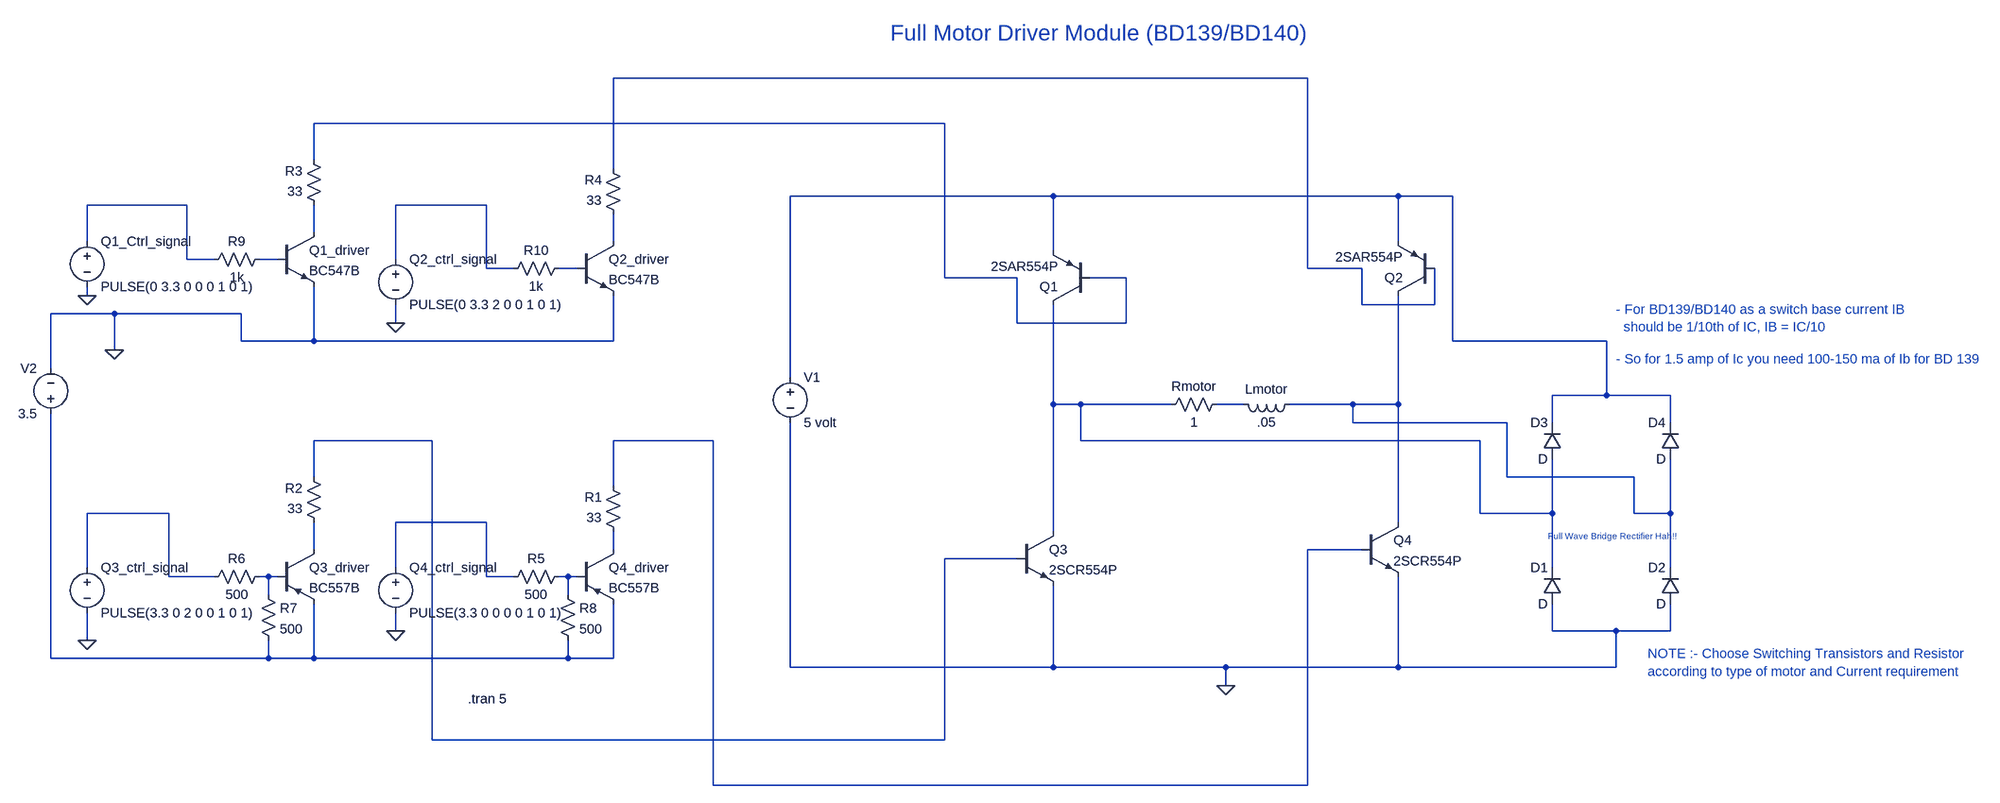
[diagram p0: schematic Full Motor Driver Module ( version 1 ).asc]
Full Motor Driver Module ( version 1 ).asc, the LTspice schematic file:
Version 4
SHEET 1 1904 980
WIRE 656 -272 -720 -272
WIRE 16 -192 -1248 -192
WIRE -1248 -128 -1248 -192
WIRE -720 -112 -720 -272
WIRE 208 -64 -256 -64
WIRE 816 -64 208 -64
WIRE 912 -64 816 -64
WIRE -1472 -48 -1648 -48
WIRE -944 -48 -1104 -48
WIRE -1248 0 -1248 -48
WIRE -1648 16 -1648 -48
WIRE -720 16 -720 -32
WIRE 816 16 816 -64
WIRE 208 32 208 -64
WIRE -1472 48 -1472 -48
WIRE -1424 48 -1472 48
WIRE -1312 48 -1344 48
WIRE -1104 48 -1104 -48
WIRE -944 64 -944 -48
WIRE -896 64 -944 64
WIRE -784 64 -816 64
WIRE 656 64 656 -272
WIRE 752 64 656 64
WIRE 16 80 16 -192
WIRE 144 80 16 80
WIRE 336 80 272 80
WIRE -1648 112 -1648 96
WIRE 752 128 752 64
WIRE 880 128 880 64
WIRE 880 128 752 128
WIRE -1600 144 -1712 144
WIRE -1376 144 -1600 144
WIRE -1104 160 -1104 128
WIRE 144 160 144 80
WIRE 336 160 336 80
WIRE 336 160 144 160
WIRE -1376 192 -1376 144
WIRE -1248 192 -1248 96
WIRE -1248 192 -1376 192
WIRE -720 192 -720 112
WIRE -720 192 -1248 192
WIRE 912 192 912 -64
WIRE 1184 192 912 192
WIRE -1600 208 -1600 144
WIRE -1712 240 -1712 144
WIRE -256 256 -256 -64
WIRE 1184 288 1184 192
WIRE 1184 288 1088 288
WIRE 1296 288 1184 288
WIRE 208 304 208 128
WIRE 256 304 208 304
WIRE 416 304 256 304
WIRE 544 304 496 304
WIRE 736 304 624 304
WIRE 816 304 816 112
WIRE 816 304 736 304
WIRE 736 336 736 304
WIRE 1008 336 736 336
WIRE 1088 336 1088 288
WIRE 1296 336 1296 288
WIRE -1040 368 -1248 368
WIRE -544 368 -720 368
WIRE 256 368 256 304
WIRE 960 368 256 368
WIRE -1248 432 -1248 368
WIRE 1008 432 1008 336
WIRE 1232 432 1008 432
WIRE -720 448 -720 368
WIRE -1504 496 -1648 496
WIRE 960 496 960 368
WIRE 1088 496 1088 400
WIRE 1088 496 960 496
WIRE 1232 496 1232 432
WIRE 1296 496 1296 400
WIRE 1296 496 1232 496
WIRE -944 512 -1104 512
WIRE 816 512 816 304
WIRE 208 528 208 304
WIRE -1248 560 -1248 512
WIRE -720 560 -720 528
WIRE 752 560 656 560
WIRE 144 576 16 576
WIRE -1648 592 -1648 496
WIRE -1104 592 -1104 512
WIRE 1088 592 1088 496
WIRE 1296 592 1296 496
WIRE -1504 608 -1504 496
WIRE -1424 608 -1504 608
WIRE -1328 608 -1344 608
WIRE -1312 608 -1328 608
WIRE -944 608 -944 512
WIRE -896 608 -944 608
WIRE -800 608 -816 608
WIRE -784 608 -800 608
WIRE -1328 640 -1328 608
WIRE -800 640 -800 608
WIRE -1104 704 -1104 672
WIRE 1088 704 1088 656
WIRE 1200 704 1088 704
WIRE 1296 704 1296 656
WIRE 1296 704 1200 704
WIRE -1648 720 -1648 672
WIRE -1712 752 -1712 320
WIRE -1328 752 -1328 720
WIRE -1328 752 -1712 752
WIRE -1248 752 -1248 656
WIRE -1248 752 -1328 752
WIRE -800 752 -800 720
WIRE -800 752 -1248 752
WIRE -720 752 -720 656
WIRE -720 752 -800 752
WIRE -256 768 -256 336
WIRE 208 768 208 624
WIRE 208 768 -256 768
WIRE 512 768 208 768
WIRE 816 768 816 608
WIRE 816 768 512 768
WIRE 1200 768 1200 704
WIRE 1200 768 816 768
WIRE 512 800 512 768
WIRE -1040 896 -1040 368
WIRE 16 896 16 576
WIRE 16 896 -1040 896
WIRE -544 976 -544 368
WIRE 656 976 656 560
WIRE 656 976 -544 976
FLAG 512 800 0
FLAG -1600 208 0
FLAG -1648 720 0
FLAG -1648 112 0
FLAG -1104 704 0
FLAG -1104 160 0
DATAFLAG -256 528 ""
SYMBOL npn 144 528 R0
SYMATTR InstName Q3
SYMATTR Value 2SCR554P
SYMBOL npn 752 512 R0
SYMATTR InstName Q4
SYMATTR Value 2SCR554P
SYMBOL res 512 288 R90
WINDOW 0 0 56 VBottom 2
WINDOW 3 32 56 VTop 2
SYMATTR InstName Rmotor
SYMATTR Value 1
SYMBOL ind 640 288 R90
WINDOW 0 5 56 VBottom 2
WINDOW 3 32 56 VTop 2
SYMATTR InstName Lmotor
SYMATTR Value .05
SYMBOL voltage -256 240 R0
WINDOW 123 0 0 Left 0
WINDOW 39 0 0 Left 0
SYMATTR InstName V1
SYMATTR Value 5 volt
SYMBOL pnp 880 112 R180
SYMATTR InstName Q2
SYMATTR Value 2SAR554P
SYMBOL pnp 272 128 R180
SYMATTR InstName Q1
SYMATTR Value 2SAR554P
SYMBOL res -704 544 R180
WINDOW 0 36 76 Left 2
WINDOW 3 36 40 Left 2
SYMATTR InstName R1
SYMATTR Value 33
SYMBOL res -1232 528 R180
WINDOW 0 36 76 Left 2
WINDOW 3 36 40 Left 2
SYMATTR InstName R2
SYMATTR Value 33
SYMBOL res -1232 -32 R180
WINDOW 0 36 76 Left 2
WINDOW 3 36 40 Left 2
SYMATTR InstName R3
SYMATTR Value 33
SYMBOL res -704 -16 R180
WINDOW 0 36 76 Left 2
WINDOW 3 36 40 Left 2
SYMATTR InstName R4
SYMATTR Value 33
SYMBOL diode 1104 656 R180
WINDOW 0 24 64 Left 2
WINDOW 3 24 0 Left 2
SYMATTR InstName D1
SYMBOL diode 1312 656 R180
WINDOW 0 24 64 Left 2
WINDOW 3 24 0 Left 2
SYMATTR InstName D2
SYMBOL diode 1104 400 R180
WINDOW 0 24 64 Left 2
WINDOW 3 24 0 Left 2
SYMATTR InstName D3
SYMBOL diode 1312 400 R180
WINDOW 0 24 64 Left 2
WINDOW 3 24 0 Left 2
SYMATTR InstName D4
SYMBOL npn -1312 0 R0
SYMATTR InstName Q1_driver
SYMATTR Value BC547B
SYMBOL npn -784 16 R0
SYMATTR InstName Q2_driver
SYMATTR Value BC547B
SYMBOL pnp -1312 560 R0
SYMATTR InstName Q3_driver
SYMATTR Value BC557B
SYMBOL pnp -784 560 R0
SYMATTR InstName Q4_driver
SYMATTR Value BC557B
SYMBOL voltage -1712 336 R180
WINDOW 0 24 96 Left 2
WINDOW 3 24 16 Left 2
WINDOW 123 0 0 Left 0
WINDOW 39 0 0 Left 0
SYMATTR InstName V2
SYMATTR Value 3.5
SYMBOL res -800 592 R90
WINDOW 0 0 56 VBottom 2
WINDOW 3 32 56 VTop 2
SYMATTR InstName R5
SYMATTR Value 500
SYMBOL res -1328 592 R90
WINDOW 0 0 56 VBottom 2
WINDOW 3 32 56 VTop 2
SYMATTR InstName R6
SYMATTR Value 500
SYMBOL res -1344 624 R0
SYMATTR InstName R7
SYMATTR Value 500
SYMBOL res -816 624 R0
SYMATTR InstName R8
SYMATTR Value 500
SYMBOL res -1328 32 R90
WINDOW 0 0 56 VBottom 2
WINDOW 3 32 56 VTop 2
SYMATTR InstName R9
SYMATTR Value 1k
SYMBOL res -800 48 R90
WINDOW 0 0 56 VBottom 2
WINDOW 3 32 56 VTop 2
SYMATTR InstName R10
SYMATTR Value 1k
SYMBOL voltage -1648 576 R0
WINDOW 123 0 0 Left 0
WINDOW 39 0 0 Left 0
SYMATTR InstName Q3_ctrl_signal
SYMATTR Value PULSE(3.3 0 2 0 0 1 0 1)
SYMBOL voltage -1648 0 R0
WINDOW 123 0 0 Left 0
WINDOW 39 0 0 Left 0
SYMATTR InstName Q1_Ctrl_signal
SYMATTR Value PULSE(0 3.3 0 0 0 1 0 1)
SYMBOL voltage -1104 576 R0
WINDOW 123 0 0 Left 0
WINDOW 39 0 0 Left 0
SYMATTR InstName Q4_ctrl_signal
SYMATTR Value PULSE(3.3 0 0 0 0 1 0 1)
SYMBOL voltage -1104 32 R0
WINDOW 123 0 0 Left 0
WINDOW 39 0 0 Left 0
SYMATTR InstName Q2_ctrl_signal
SYMATTR Value PULSE(0 3.3 2 0 0 1 0 1)
TEXT -80 -352 Left 4 ;Full Motor Driver Module (BD139/BD140)
TEXT 1256 744 Left 2 ;NOTE :- Choose Switching Transistors and Resistor \naccording to type of motor and Current requirement
TEXT 1200 136 Left 2 ;- For BD139/BD140 as a switch base current IB\n  should be 1/10th of IC, IB = IC/10
TEXT 1200 224 Left 2 ;- So for 1.5 amp of Ic you need 100-150 ma of Ib for BD 139
TEXT -976 824 Left 2 !.tran 5
TEXT 1080 536 Left 1 ;Full Wave Bridge Rectifier Hah!!

The netlist it stands for:
* Full Motor Driver Module ( version 1 ).asc
Q3 N010 N013 0 0 2SCR554P
Q4 N012 N014 0 0 2SCR554P
Rmotor N011 N010 1
Lmotor N012 N011 .05
V1 N003 0 5 volt
Q2 N012 N001 N003 0 2SAR554P
Q1 N010 N002 N003 0 2SAR554P
R1 N018 N014 33
R2 N017 N013 33
R3 N006 N002 33
R4 N007 N001 33
D1 0 N010 D
D2 0 N012 D
D3 N010 N003 D
D4 N012 N003 D
Q1_driver N006 N008 0 0 BC547B
Q2_driver N007 N009 0 0 BC547B
Q3_driver N017 N019 N021 0 BC557B
Q4_driver N018 N020 N021 0 BC557B
V2 N021 0 3.5
R5 N020 N016 500
R6 N019 N015 500
R7 N019 N021 500
R8 N020 N021 500
R9 N008 N004 1k
R10 N009 N005 1k
V§Q3_ctrl_signal N015 0 PULSE(3.3 0 2 0 0 1 0 1)
V§Q1_Ctrl_signal N004 0 PULSE(0 3.3 0 0 0 1 0 1)
V§Q4_ctrl_signal N016 0 PULSE(3.3 0 0 0 0 1 0 1)
V§Q2_ctrl_signal N005 0 PULSE(0 3.3 2 0 0 1 0 1)
.model D D
.lib standard.dio
.model NPN NPN
.model PNP PNP
.lib standard.bjt
* Full Motor Driver Module (BD139/BD140)
* NOTE :- Choose Switching Transistors and Resistor
* according to type of motor and Current requirement
* - For BD139/BD140 as a switch base current IB
*   should be 1/10th of IC, IB = IC/10
* - So for 1.5 amp of Ic you need 100-150 ma of Ib for BD 139
.tran 5
* Full Wave Bridge Rectifier Hah!!
.backanno
.end